# EAGLE design schematic-BCE (EAGLE 6.6.0)
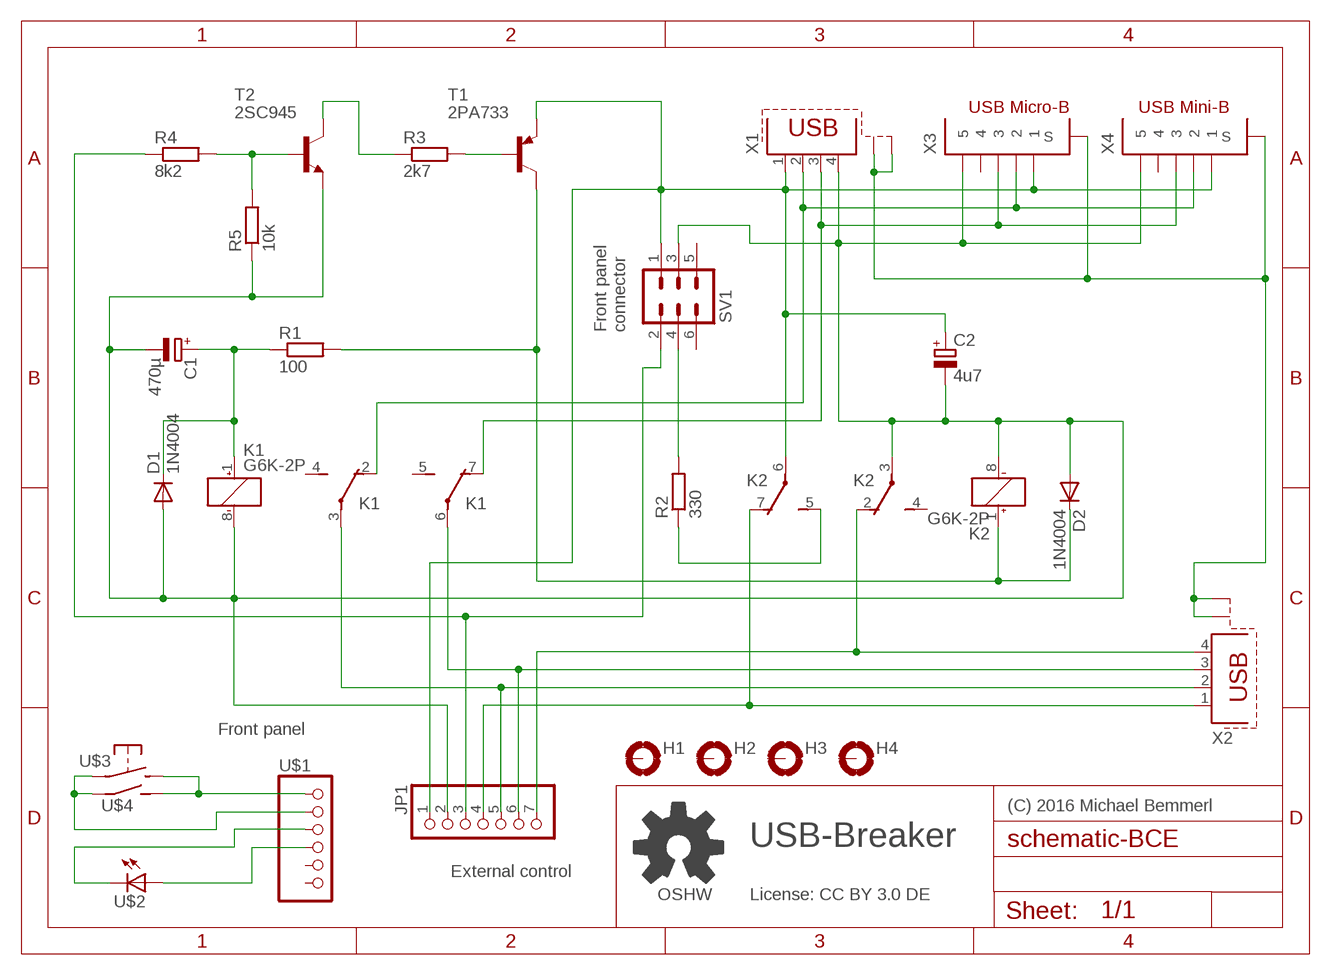
[diagram p0: schematic, sheet 1]

## Parts
C1  470µ  CPOL-EUE3.5-8  [E3,5-8]
C2  4u7  CPOL-EUE2.5-6  [E2,5-6]
D1  1N4004  [DO41-10]
D2  1N4004  [DO41-10]
H1  MOUNT-PAD-ROUND3.0  [3,0-PAD]
H2  MOUNT-PAD-ROUND3.0  [3,0-PAD]
H3  MOUNT-PAD-ROUND3.0  [3,0-PAD]
H4  MOUNT-PAD-ROUND3.0  [3,0-PAD]
JP1  PINHD-1X7/90  [1X07/90]
K1  G6K-2P  [G6K-2P]
K2  G6K-2P  [G6K-2P]
R1  100  R-EU_0207/10  [0207/10]
R2  330  R-EU_0207/10  [0207/10]
R3  2k7  R-EU_0207/10  [0207/10]
R4  8k2  R-EU_0207/10  [0207/10]
R5  10k  R-EU_0207/10  [0207/10]
SV1  ML6  [ML6]
T1  2PA733  [TO92-ECB]
T2  2SC945  [TO92-ECB]
U$1  EXTERNAL_CONNECTOR_6  (no package)
U$2  EXTERNAL_LED  (no package)
U$3  EXTERNAL_PUSH_BUTTON  (no package)
U$4  EXTERNAL_SWITCH  (no package)
X1  PN61729-S  [PN61729-S]
X2  PN87520-S  [PN87520-S]
X3  10104110  [10104110-0001LF]
X4  UX60SC-MB-5ST  [UX60SC-MB-5ST]

## Nets
D+_IN [USB data]: K1.7(3:O) X1.3 X3.P$3 X4.P$3
D+_OUT: JP1.6 K1.6(3:P) X2.3
D-_IN [USB data]: K1.2(2:O) X1.2 X3.P$2 X4.P$2
D-_OUT: JP1.5 K1.3(2:P) X2.2
ENABLE: D2.C K2.1(1:+) R1.2 T1.C
EXTERNAL_ENABLE: JP1.3 R4.1 SV1.2 U$1.2 U$3.P U$4.1
GND_IN [Power]: C1.- C2.- D1.A D2.A JP1.2 K1.8(1:-) K2.3(2:P) K2.8(1:-) R5.1 SV1.3 T2.E U$1.3 U$2.C X1.4 X3.P$5 X4.P$5
GND_OUT [Power]: JP1.7 K2.2(2:O) X2.4
LED: R2.2 SV1.4 U$1.4 U$2.A
N$1: R3.2 T1.B
N$2: R3.1 T2.C
N$3: R4.2 R5.2 T2.B
N$8: C1.+ D1.C K1.1(1:+) R1.1
SHIELD: X1.S1 X1.S2 X2.S1 X2.S2 X3.P$6(S) X3.P$7(S) X4.P$6(S) X4.P$7(S)
VCC_IN [Power]: C2.+ JP1.1 K2.6(3:P) SV1.1 T1.E U$1.1 U$3.S U$4.2 X1.1 X3.P$1 X4.P$1
VCC_LED: K2.5(3:S) R2.1
VCC_OUT [Power]: JP1.4 K2.7(3:O) X2.1
Unconnected: H1.B3,0(MOUNT) H2.B3,0(MOUNT) H3.B3,0(MOUNT) H4.B3,0(MOUNT) K1.4(2:S) K1.5(3:S) K2.4(2:S) SV1.5 SV1.6 U$1.5 U$1.6 X3.P$4 X4.P$4

## Notes on the sheet
- Front panel
  connector
- Front panel
- (C) 2016 Michael Bemmerl
- USB-Breaker
- External control
- OSHW | License: CC BY 3.0 DE

## Library data of the parts
C1 C2 = resistor:CPOL-EU: POLARIZED CAPACITOR, European symbol
D1 D2 = diode:1N4004: DIODE general purpose rectifier, 1 A
H1-H4 = holes:MOUNT-PAD-ROUND: MOUNTING PAD, round
JP1 = pinhead:PINHD-1X7: PIN HEADER
K1 K2 = relay:G6K: Low Signal Relay oeiwcsnts1.omron.com/.. D20G6K0100.pdf; MF: OMRON COMPONENTS USA; MPN: G6K-2P DC3; OC_FARNELL: 3937276; OC_NEWARK: 89C6482
R1-R5 = resistor:R-EU_: RESISTOR, European symbol
SV1 = con-harting-ml:ML6: HARTING; OC_FARNELL: unknown; OC_NEWARK: unknown
T1 = mibe:2PA733: PNP general purpose transistor IC: -100 mA VCEO: -50 V hFE @ -1 mA, -6 V: 200-400
T2 = transistor:2SC945: NPN Silicon Epitaxial Planar Transistor Source: SEMTECH ELECTRONICS LTD. ... 2SC945 2.pdf
U$1 = mibe:EXTERNAL_CONNECTOR_6: 6 pin connector with _EXTERNAL_ attribute.
U$2 = mibe:EXTERNAL_LED: LED with _EXTERNAL_ attribute.
U$3 = mibe:EXTERNAL_PUSH_BUTTON: Push button with _EXTERNAL_ attribute.
U$4 = mibe:EXTERNAL_SWITCH: Switch with _EXTERNAL_ attribute.
X1 = con-berg:PN61729-S: BERG USB connector; OC_FARNELL: unknown; OC_NEWARK: unknown
X2 = con-berg:PN87520-S; OC_FARNELL: unknown; OC_NEWARK: unknown
X3 = mibe:10104110: 10104110 - Micro USB B Type Receptacle
X4 = mibe:UX60S: UX60S Series - Mini-B Connectors, SMT mount receptacles meeting requirements of USB 2.0 Standard

## Net classes
1 USB data: width 0.406 mm, clearance 0.254 mm
2 Power: width 0.508 mm, clearance 0.254 mm

## Board
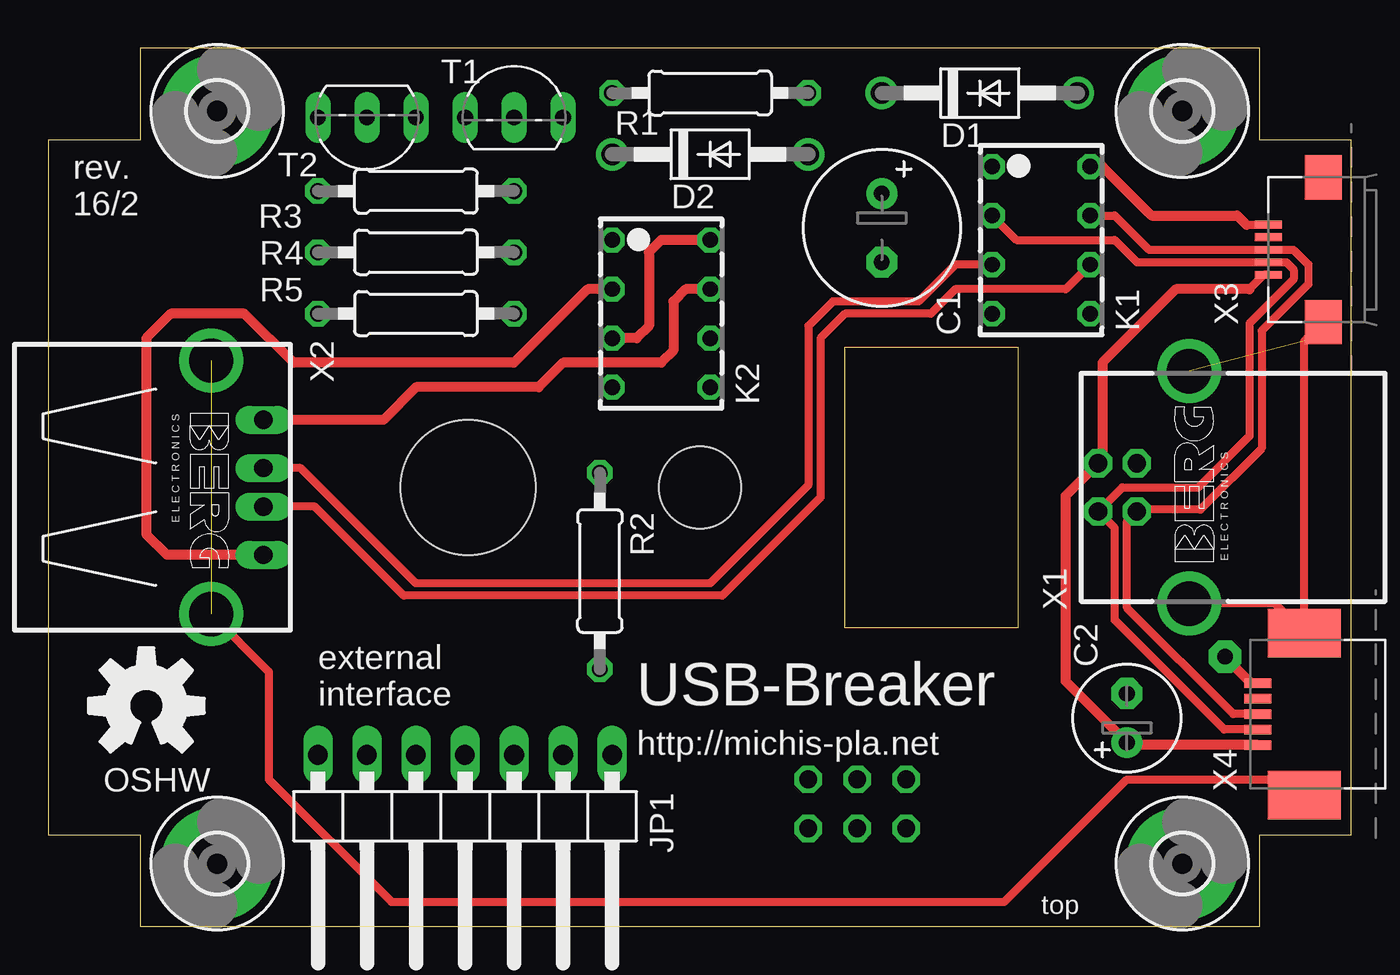
[diagram p1: board, top side]
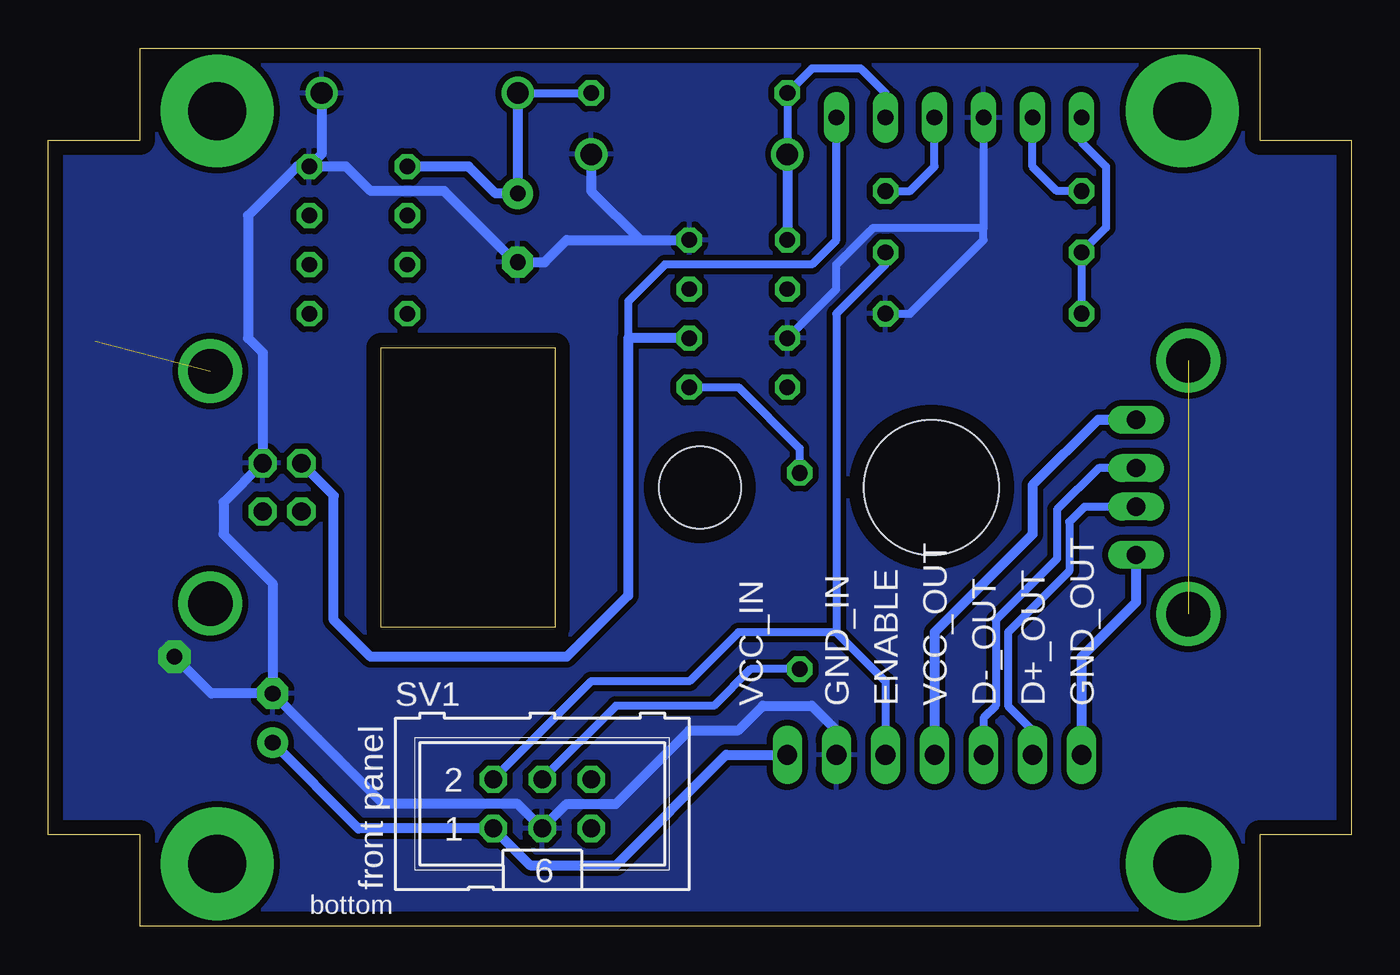
[diagram p2: board, bottom side, seen from below]

Size 67.5 x 45.5 mm. Coordinates in mm from the lower left corner, seen from the top.
Outline: 4.75,0 62.75,0 62.75,4.75 67.5,4.75 67.5,40.75 62.75,40.75 62.75,45.5 4.75,45.5 4.75,40.75 0,40.75 0,4.75 4.75,4.75 4.75,0
Outline: 41.25,30 41.25,15.5 50.25,15.5 50.25,30 41.25,30
Copper layers (1*16): Top 0.035mm / dielectric 1.5mm / Bottom 0.035mm
Design rules "default *": minimum track width 10mil, minimum drill 12mil, track to track 6mil, track to pad 6mil, pad to pad 6mil, via to via 6mil, smd to smd 6mil, copper to edge 30mil, drill to drill 8mil, minimum pad ring 10mil, minimum via ring 8mil, stop-mask expansion 4mil, vias tented up to drill 0mil, thermal gap 12mil
Holes 7 mm at 21.75,22.75
Holes 4.25 mm at 33.75,22.75

### Footprints (pad centres in the part's own frame; a part is rotated, then mirrored left to right if it is on the bottom)
E3,5-8 = drill 0.813 pad 1.6: + -1.778,0 | drill 0.813 pad 1.6 octagon: - 1.778,0
E2,5-6 = drill 0.813 pad 1.6: + -1.27,0 | drill 0.813 pad 1.6 octagon: - 1.27,0
DO41-10 = drill 1.118: A 5.08,0; C -5.08,0
3,0-PAD = drill 3 pad 5.842: B3,0 0,0
1X07/90 = drill 1.016 long: 1 -7.62,-3.81; 2 -5.08,-3.81; 3 -2.54,-3.81; 4 0,-3.81; 5 2.54,-3.81; 6 5.08,-3.81; 7 7.62,-3.81
G6K-2P = drill 0.8 octagon: 1 -2.54,-2.54; 2 0,-2.54; 3 2.54,-2.54; 4 5.08,-2.54; 5 5.08,2.54; 6 2.54,2.54; 7 0,2.54; 8 -2.54,2.54
0207/10 = drill 0.813 octagon: 1 -5.08,0; 2 5.08,0
ML6 = drill 0.914 octagon: 1 -2.54,-1.27; 2 -2.54,1.27; 3 0,-1.27; 4 0,1.27; 5 2.54,-1.27; 6 2.54,1.27
TO92-BCE = drill 0.813 long: B -2.54,0; C 0,0; E 2.54,0
TO92-ECB = drill 0.813 long: B 2.54,0; C 0,0; E -2.54,0
PN61729-S = drill 0.95 octagon: 1 1.25,4.71; 2 -1.25,4.71; 3 -1.25,2.71; 4 1.25,2.71 | drill 2.3 pad 2.9: S1 -6.02,0; S2 6.02,0
PN87520-S = drill 0.95 long: 1 -3.5,2.71; 2 -1,2.71; 3 1,2.71; 4 3.5,2.71 | drill 2.3 pad 2.9: S1 -6.57,0; S2 6.57,0
10104110-0001LF = smd 0.4 x 1.4: P$1 -1.3,4.3; P$2 -0.65,4.3; P$3 0,4.3; P$4 0.65,4.3; P$5 1.3,4.3 | smd 2.3 x 1.9: P$6 -3.75,1.45; P$7 3.75,1.45
UX60SC-MB-5ST = smd 0.5 x 1.4: P$1 -1.6,6.1; P$2 -0.8,6.1; P$3 0,6.1; P$4 0.8,6.1; P$5 1.6,6.1 | smd 2.5 x 3.8: P$6 -4.2,3.7; P$7 4.2,3.7

### Placement (x,y rotation side)
C1  43.18,36.2 270 top
C2  55.88,10.79 90 top
D1  48.26,43.18 0 top
D2  34.29,40.01 0 top
H1  8.75,3.25 0 top
H2  8.75,42.25 0 top
H3  58.75,3.25 0 top
H4  58.75,42.25 0 top
JP1  21.59,5.08 180 top
K1  51.44,36.83 270 top
K2  31.75,33.02 270 top
R1  34.29,43.18 180 top
R2  28.57,18.41 270 top
R3  19.05,38.1 0 top
R4  19.05,34.92 180 top
R5  19.05,31.75 180 top
SV1  41.91,6.35 0 bottom
T1  2PA733  [TO92-BCE]  24.13,41.91 0 top
T2  16.51,41.91 180 top
X1  59.1,22.75 90 top
X2  8.44,22.75 270 top
X3  67.5,35.06 90 top
X4  68.77,11 90 top

### Tracks (layer width: path | path; a pad name or v marks a point on that pad's centre or on a via)
D+_IN
  Top 0.406: X4.P$3 61.39,11 55.88,16.51 55.88,20.99 X1.3 56.48,21.59 59.69,21.59 62.87,24.77 62.87,30.86 65.28,33.27 65.28,34.29 64.51,35.06 X3.P$3 57.02,35.06 55.24,36.83 K1.7
D+_OUT
  Top 0.406: K1.6 52.7,33.02 46.99,33.02 45.72,31.75 41.27,31.75 40.01,30.48 40.01,22.23 34.92,17.14 18.41,17.14 13.81,21.75 X2.3
  Bottom 0.406: JP1.6 16.51,10.16 17.78,11.43 17.78,15.24 14.61,18.41 14.61,20.95 13.81,21.75 X2.3
D-_IN
  Top 0.406: X4.P$2 60.92,10.2 55.24,15.88 55.24,20.64 X1.2 55.64,22.75 59.58,22.75 62.23,25.4 62.23,31.24 64.52,33.53 64.52,34.04 64.14,34.41 X3.P$2 56.4,34.41 55.24,35.56 50.16,35.56 K1.2
D-_OUT
  Top 0.406: K1.3 46.99,34.29 45.09,32.38 40.64,32.38 39.37,31.11 39.37,22.86 34.29,17.78 19.05,17.78 13.08,23.75 X2.2
  Bottom 0.406: X2.2 13.08,23.75 15.24,21.59 15.24,19.05 18.41,15.88 18.41,11.43 19.05,10.79 JP1.5
ENABLE
  Bottom 0.406: D2.C R1.2 27.94,44.45 25.4,44.45 24.13,43.18 T1.C
  Bottom 0.508: D2.C K2.1
EXTERNAL_ENABLE
  Bottom 0.406: 26.67,15.24 24.13,12.7 JP1.3 | 26.67,15.24 26.67,31.75 24.13,34.29 R4.1 | 26.67,15.24 31.75,15.24 34.29,12.7 39.37,12.7 SV1.2
GND_IN  (via drill 0.8 pad 1.68)
  Top 0.406: 62.06,36.36 X3.P$5
  Top 0.508: X4.P$5 62.33,12.6 v60.96,13.97 | 62.06,36.36 61.59,36.83 57.15,36.83 54.61,39.37 K1.8 | K2.8 31.75,35.56 31.11,34.92 31.11,31.11 30.48,30.48 K2.3
  Bottom 0.406: 19.05,36.2 19.05,35.56 22.86,31.75 R5.1 | K2.3 26.67,33.02 26.67,34.29 24.77,36.2 19.05,36.2 | T2.E 19.05,36.2
  Bottom 0.508: C2.- 50.16,6.35 43.18,6.35 SV1.3 40.64,6.35 38.1,6.35 34.29,10.16 31.75,10.16 30.48,11.43 27.94,11.43 26.67,10.16 JP1.2 | C2.- 59.05,12.06 v60.96,13.97 | D1.A 53.34,40.01 K1.8 | C2.- 55.88,17.78 58.42,20.32 58.42,21.97 X1.4 56.39,29.72 57.15,30.48 57.15,36.83 54.61,39.37 K1.8 | K1.8 52.07,39.37 50.8,38.1 46.99,38.1 43.31,34.42 C1.- 41.78,34.42 40.64,35.56 36.83,35.56 | D2.A 39.37,38.1 36.83,35.56 | 36.83,35.56 K2.8
  pour Bottom (isolate 0.305): -1.27,-1.27 69.85,-1.27 69.85,46.99 -1.27,46.99
GND_OUT
  Top 0.508: K2.2 27.94,33.02 24.13,29.21 12.7,29.21 10.16,31.75 6.35,31.75 5.08,30.48 5.08,20.32 6.15,19.25 X2.4
  Bottom 0.508: JP1.7 13.97,13.97 11.15,16.79 X2.4
LED
  Bottom 0.406: R2.2 31.11,13.34 33.02,11.43 38.1,11.43 SV1.4
N$1
  Bottom 0.406: R3.2 22.86,38.1 21.59,39.37 T1.B
N$2
  Bottom 0.406: R3.1 15.24,38.1 16.51,39.37 T2.C
N$3
  Bottom 0.406: R5.2 R4.2 12.7,36.2 12.7,39.37 13.97,40.64 T2.B
N$8
  Bottom 0.406: D1.C R1.1
  Bottom 0.508: D1.C C1.+ 44.32,37.97 45.72,39.37 K1.1
SHIELD  (2 unrouted)
  Top 0.406: X3.P$6 65.07,30.33 X4.P$7 63.54,16.73 X1.S1 | X2.S2 11.43,13.19 11.43,7.62 17.78,1.27 49.53,1.27 55.88,7.62 64.25,7.62 X4.P$6
VCC_IN
  Top 0.406: X3.P$1 62.97,33.76 62.23,33.02
  Top 0.508: X4.P$1 56.01,9.4 C2.+ 52.7,12.7 52.7,22.32 X1.1 54.61,24.22 54.61,29.21 58.42,33.02 62.23,33.02
  Bottom 0.406: 37.47,30.48 37.47,32.38 35.56,34.29 27.94,34.29 26.67,35.56 T1.E
  Bottom 0.508: JP1.1 32.38,8.89 38.1,3.17 42.55,3.17 SV1.1 51.44,5.08 C2.+ | K2.6 37.47,30.48 37.47,17.14 40.64,13.97 50.8,13.97 52.7,15.88 52.7,22.32 X1.1
VCC_LED
  Bottom 0.406: K2.5 31.75,27.94 28.57,24.77 R2.1
VCC_OUT
  Top 0.508: K2.7 33.02,33.02 32.38,32.38 32.38,29.84 31.75,29.21 26.67,29.21 25.4,27.94 19.05,27.94 17.36,26.25 X2.1
  Bottom 0.508: JP1.4 21.59,15.24 16.51,20.32 16.51,22.86 13.12,26.25 X2.1

### Text on the board
tPlace: rev. / 16/2 | external / interface | USB-Breaker | http://michis-pla.net | OSHW | top
bPlace: GND_OUT | D+_OUT | D-_OUT | VCC_OUT | ENABLE | GND_IN | VCC_IN | front panel | bottom